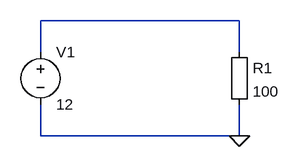
[diagram p0: schematic Versuch1 Schaltung 1.asc]
Versuch1 Schaltung 1.asc, the LTspice schematic file:
Version 4
SHEET 1 880 680
WIRE 304 80 0 80
WIRE 0 128 0 80
WIRE 304 128 304 80
WIRE 0 256 0 208
WIRE 304 256 304 208
WIRE 304 256 0 256
FLAG 304 256 0
SYMBOL Misc\\EuropeanResistor 288 112 R0
SYMATTR InstName R1
SYMATTR Value 100
SYMBOL voltage 0 112 R0
SYMATTR InstName V1
SYMATTR Value 12

The netlist it stands for:
* Versuch1 Schaltung 1.asc
R1 N001 0 100
V1 N001 0 12
.backanno
.end